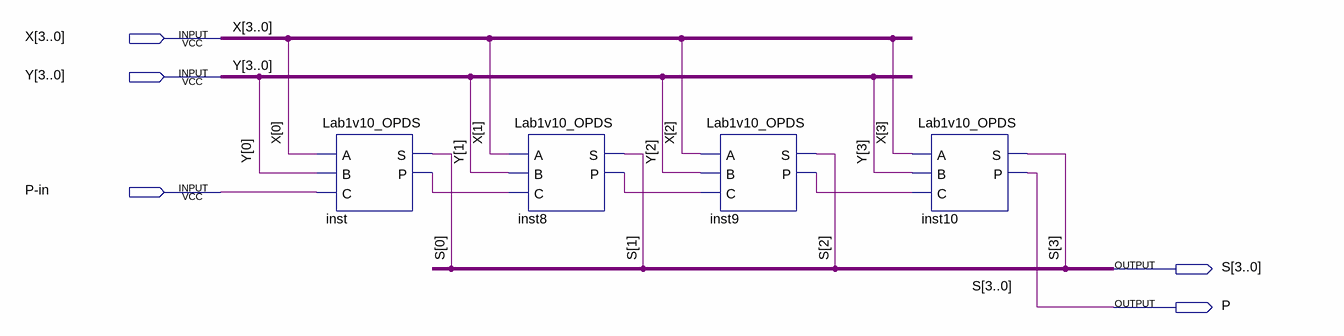
[diagram p0: schematic sheet]
// Quartus schematic Task4-5.bdf as structural Verilog: 4 symbols, 5 pins
module \Task4-5  (
  input  [3:0] X,
  input  [3:0] Y,
  input  \P-in ,
  output [3:0] S,
  output P
);

  wire inst8_p, inst9_p, inst_p;

  Lab1v10_OPDS inst (.A(X[0]), .B(Y[0]), .C(\P-in ), .S(S[0]), .P(inst_p));
  Lab1v10_OPDS inst8 (.A(X[1]), .B(Y[1]), .C(inst_p), .S(S[1]), .P(inst8_p));
  Lab1v10_OPDS inst9 (.A(X[2]), .B(Y[2]), .C(inst8_p), .S(S[2]), .P(inst9_p));
  Lab1v10_OPDS inst10 (.A(X[3]), .B(Y[3]), .C(inst9_p), .S(S[3]), .P(P));
endmodule
